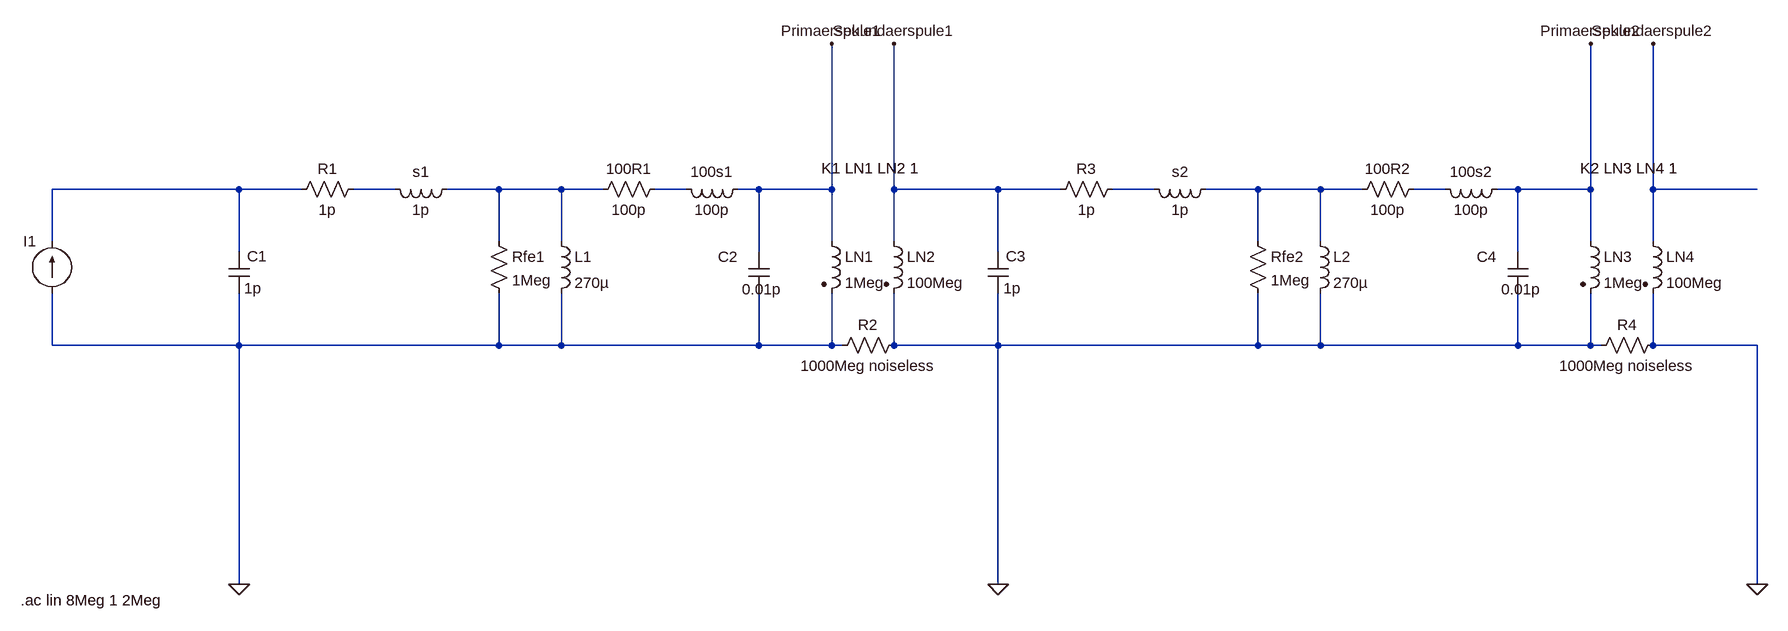
[diagram p0: schematic transformers_cascaded.asc]
transformers_cascaded.asc, the LTspice schematic file:
Version 4
SHEET 1 3092 2864
WIRE -1280 -128 -1568 -128
WIRE -1184 -128 -1280 -128
WIRE -1040 -128 -1104 -128
WIRE -880 -128 -960 -128
WIRE -784 -128 -880 -128
WIRE -720 -128 -784 -128
WIRE -592 -128 -640 -128
WIRE -480 -128 -512 -128
WIRE -368 -128 -368 -352
WIRE -368 -128 -480 -128
WIRE -272 -128 -272 -352
WIRE -112 -128 -272 -128
WIRE -16 -128 -112 -128
WIRE 128 -128 64 -128
WIRE 288 -128 208 -128
WIRE 384 -128 288 -128
WIRE 448 -128 384 -128
WIRE 576 -128 528 -128
WIRE 688 -128 656 -128
WIRE 800 -128 800 -352
WIRE 800 -128 688 -128
WIRE 896 -128 896 -352
WIRE 1056 -128 896 -128
WIRE -1568 -48 -1568 -128
WIRE -880 -48 -880 -128
WIRE -784 -48 -784 -128
WIRE -368 -48 -368 -128
WIRE -272 -48 -272 -128
WIRE 288 -48 288 -128
WIRE 384 -48 384 -128
WIRE 800 -48 800 -128
WIRE 896 -48 896 -128
WIRE -1280 -32 -1280 -128
WIRE -480 -32 -480 -128
WIRE -112 -32 -112 -128
WIRE 688 -32 688 -128
WIRE -1568 112 -1568 32
WIRE -1280 112 -1280 32
WIRE -1280 112 -1568 112
WIRE -880 112 -880 32
WIRE -880 112 -1280 112
WIRE -784 112 -784 32
WIRE -784 112 -880 112
WIRE -480 112 -480 32
WIRE -480 112 -784 112
WIRE -368 112 -368 32
WIRE -368 112 -480 112
WIRE -352 112 -368 112
WIRE -272 112 -272 32
WIRE -112 112 -112 32
WIRE -112 112 -272 112
WIRE 288 112 288 32
WIRE 288 112 -112 112
WIRE 384 112 384 32
WIRE 384 112 288 112
WIRE 688 112 688 32
WIRE 688 112 384 112
WIRE 800 112 800 32
WIRE 800 112 688 112
WIRE 816 112 800 112
WIRE 896 112 896 32
WIRE 1056 112 896 112
WIRE -1280 480 -1280 112
WIRE -112 480 -112 112
WIRE 1056 480 1056 112
FLAG -368 -352 Primaerspule1
FLAG -272 -352 Sekundaerspule1
FLAG -1280 480 0
FLAG 800 -352 Primaerspule2
FLAG 896 -352 Sekundaerspule2
FLAG -112 480 0
FLAG 1056 480 0
SYMBOL cap -1296 -32 R0
WINDOW 0 28 7 Left 2
SYMATTR InstName C1
SYMATTR Value 1p
SYMBOL res -1088 -144 R90
WINDOW 0 0 56 VBottom 2
WINDOW 3 32 56 VTop 2
SYMATTR InstName R1
SYMATTR Value 1p
SYMBOL res -896 -64 R0
SYMATTR InstName Rfe1
SYMATTR Value 1Meg
SYMBOL ind -944 -144 R90
WINDOW 0 5 56 VBottom 2
WINDOW 3 32 56 VTop 2
SYMATTR InstName s1
SYMATTR Value 1p
SYMBOL ind -800 -64 R0
SYMATTR InstName L1
SYMATTR Value 270µ
SYMBOL res -624 -144 R90
WINDOW 0 0 56 VBottom 2
WINDOW 3 32 56 VTop 2
SYMATTR InstName 100R1
SYMATTR Value 100p
SYMBOL cap -496 -32 R0
WINDOW 0 -47 8 Left 2
WINDOW 3 -10 58 Left 2
SYMATTR InstName C2
SYMATTR Value 0.01p
SYMBOL ind2 -384 -64 R0
SYMATTR InstName LN1
SYMATTR Value 1Meg
SYMATTR Type ind
SYMATTR SpiceLine Ipk=10000 Rser=0 Rpar=0 Cpar=0
SYMBOL ind2 -288 -64 R0
SYMATTR InstName LN2
SYMATTR Value 100Meg
SYMATTR Type ind
SYMBOL ind -496 -144 R90
WINDOW 0 5 56 VBottom 2
WINDOW 3 32 56 VTop 2
SYMATTR InstName 100s1
SYMATTR Value 100p
SYMBOL res -256 96 R90
WINDOW 0 0 56 VBottom 2
WINDOW 3 32 56 VTop 2
SYMATTR InstName R2
SYMATTR Value 1000Meg noiseless
SYMBOL cap -128 -32 R0
WINDOW 0 28 7 Left 2
SYMATTR InstName C3
SYMATTR Value 1p
SYMBOL res 80 -144 R90
WINDOW 0 0 56 VBottom 2
WINDOW 3 32 56 VTop 2
SYMATTR InstName R3
SYMATTR Value 1p
SYMBOL res 272 -64 R0
SYMATTR InstName Rfe2
SYMATTR Value 1Meg
SYMBOL ind 224 -144 R90
WINDOW 0 5 56 VBottom 2
WINDOW 3 32 56 VTop 2
SYMATTR InstName s2
SYMATTR Value 1p
SYMBOL ind 368 -64 R0
SYMATTR InstName L2
SYMATTR Value 270µ
SYMBOL res 544 -144 R90
WINDOW 0 0 56 VBottom 2
WINDOW 3 32 56 VTop 2
SYMATTR InstName 100R2
SYMATTR Value 100p
SYMBOL cap 672 -32 R0
WINDOW 0 -47 8 Left 2
WINDOW 3 -10 58 Left 2
SYMATTR InstName C4
SYMATTR Value 0.01p
SYMBOL ind2 784 -64 R0
SYMATTR InstName LN3
SYMATTR Value 1Meg
SYMATTR Type ind
SYMATTR SpiceLine Ipk=10000 Rser=0 Rpar=0 Cpar=0
SYMBOL ind2 880 -64 R0
SYMATTR InstName LN4
SYMATTR Value 100Meg
SYMATTR Type ind
SYMBOL ind 672 -144 R90
WINDOW 0 5 56 VBottom 2
WINDOW 3 32 56 VTop 2
SYMATTR InstName 100s2
SYMATTR Value 100p
SYMBOL res 912 96 R90
WINDOW 0 0 56 VBottom 2
WINDOW 3 32 56 VTop 2
SYMATTR InstName R4
SYMATTR Value 1000Meg noiseless
SYMBOL current -1568 32 R180
WINDOW 0 24 80 Left 2
WINDOW 3 24 0 Invisible 2
SYMATTR InstName I1
SYMATTR Value SINE(0 0)
SYMATTR Value2 AC 1 0
TEXT -384 -160 Left 2 !K1 LN1 LN2 1
TEXT 784 -160 Left 2 !K2 LN3 LN4 1
TEXT -1616 504 Left 2 !.ac lin 8Meg 1 2Meg

The netlist it stands for:
* transformers_cascaded.asc
C1 N001 0 1p
R1 N002 N001 1p
Rfe1 N003 0 1Meg
L§s1 N003 N002 1p
L1 N003 0 270µ
R§100R1 N004 N003 100p
C2 Primaerspule1 0 0.01p
LN1 Primaerspule1 0 1Meg Ipk=10000 Rser=0 Rpar=0 Cpar=0
LN2 Sekundaerspule1 0 100Meg
L§100s1 Primaerspule1 N004 100p
R2 0 0 1000Meg noiseless
C3 Sekundaerspule1 0 1p
R3 N005 Sekundaerspule1 1p
Rfe2 N006 0 1Meg
L§s2 N006 N005 1p
L2 N006 0 270µ
R§100R2 N007 N006 100p
C4 Primaerspule2 0 0.01p
LN3 Primaerspule2 0 1Meg Ipk=10000 Rser=0 Rpar=0 Cpar=0
LN4 Sekundaerspule2 0 100Meg
L§100s2 Primaerspule2 N007 100p
R4 0 0 1000Meg noiseless
I1 0 N001 SINE(0 0) AC 1 0
K1 LN1 LN2 1
K2 LN3 LN4 1
.ac lin 8Meg 1 2Meg
.backanno
.end